# Altium schematic sheet ESP32.SchDoc
size A4; SheetNumber: 2; SheetTotal: 5
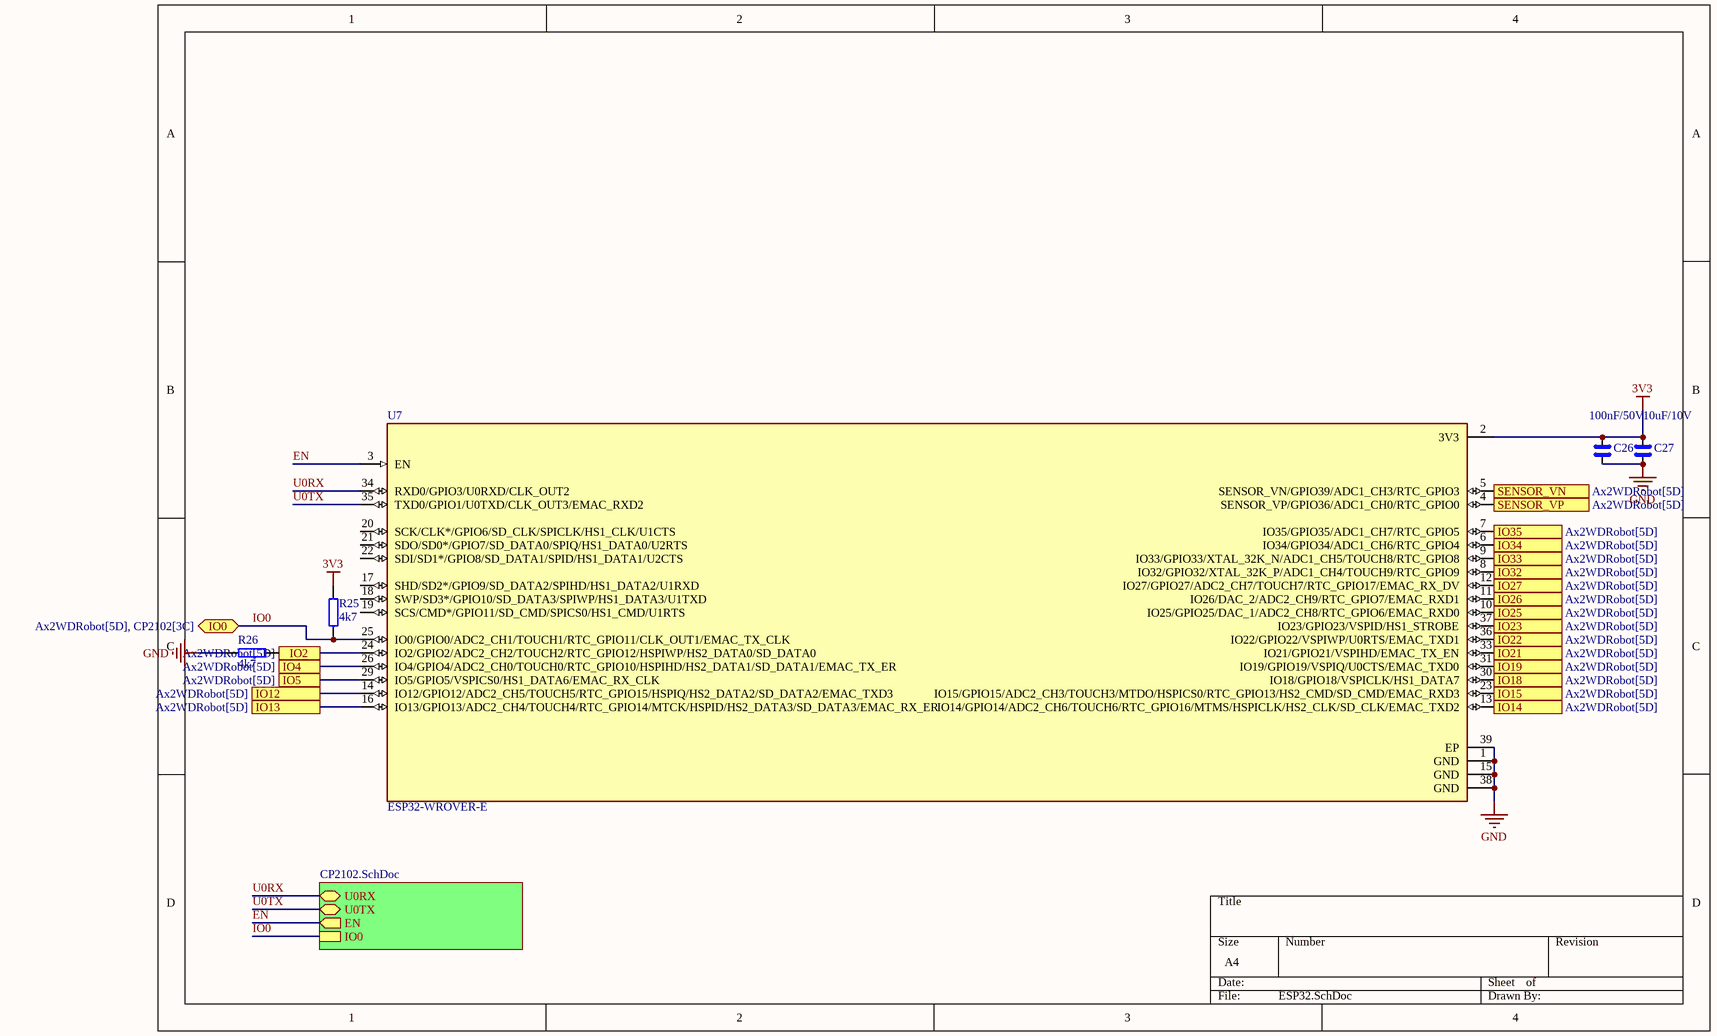
[diagram p0: ESP32.SchDoc]

## Parts
C26  100nF/50V  [1608[0603]]
C27  10uF/10V  [1608[0603]]
R25  4k7  [1608[0603]]
R26  4k7  [1608[0603]]
U7  ESP32-WROVER-E  [XCVR_ESP32-WROVER]

## Sub-sheets
? = CP2102.SchDoc: U0RX (bidir), U0TX (bidir), EN (out), IO0

## Ports
IO0 (bidir, see Ax2WDRobot[5D], CP2102[3C]), IO2 (see Ax2WDRobot[5D]), IO4 (see Ax2WDRobot[5D]), IO5 (see Ax2WDRobot[5D]), IO12 (see Ax2WDRobot[5D]), IO13 (see Ax2WDRobot[5D]), IO14 (see Ax2WDRobot[5D]), IO15 (see Ax2WDRobot[5D]), IO18 (see Ax2WDRobot[5D]), IO19 (see Ax2WDRobot[5D]), IO21 (see Ax2WDRobot[5D]), IO22 (see Ax2WDRobot[5D]), IO23 (see Ax2WDRobot[5D]), IO25 (see Ax2WDRobot[5D]), IO26 (see Ax2WDRobot[5D]), IO27 (see Ax2WDRobot[5D]), IO32 (see Ax2WDRobot[5D]), IO33 (see Ax2WDRobot[5D]), IO34 (see Ax2WDRobot[5D]), IO35 (see Ax2WDRobot[5D]), SENSOR_VN (see Ax2WDRobot[5D]), SENSOR_VP (see Ax2WDRobot[5D])

## Nets
3V3: C26.1 C27.1 R25.2 U7.2(3V3)
GND: C26.2 C27.2 R26.1 U7.1(GND) U7.15(GND) U7.38(GND) U7.39(EP)
EN: U7.3(EN) ; sheet /EN
IO0: R25.1 U7.25(IO0/GPIO0/ADC2_CH1/TOUCH1/RTC_GPIO11/CLK_OUT1/EMAC_TX_CLK) ; port IO0, sheet /IO0
IO2: R26.2 U7.24(IO2/GPIO2/ADC2_CH2/TOUCH2/RTC_GPIO12/HSPIWP/HS2_DATA0/SD_DATA0) ; port IO2
IO4: U7.26(IO4/GPIO4/ADC2_CH0/TOUCH0/RTC_GPIO10/HSPIHD/HS2_DATA1/SD_DATA1/EMAC_TX_ER) ; port IO4
IO5: U7.29(IO5/GPIO5/VSPICS0/HS1_DATA6/EMAC_RX_CLK) ; port IO5
IO12: U7.14(IO12/GPIO12/ADC2_CH5/TOUCH5/RTC_GPIO15/HSPIQ/HS2_DATA2/SD_DATA2/EMAC_TXD3) ; port IO12
IO13: U7.16(IO13/GPIO13/ADC2_CH4/TOUCH4/RTC_GPIO14/MTCK/HSPID/HS2_DATA3/SD_DATA3/EMAC_RX_ER) ; port IO13
IO14: U7.13(IO14/GPIO14/ADC2_CH6/TOUCH6/RTC_GPIO16/MTMS/HSPICLK/HS2_CLK/SD_CLK/EMAC_TXD2) ; port IO14
IO15: U7.23(IO15/GPIO15/ADC2_CH3/TOUCH3/MTDO/HSPICS0/RTC_GPIO13/HS2_CMD/SD_CMD/EMAC_RXD3) ; port IO15
IO18: U7.30(IO18/GPIO18/VSPICLK/HS1_DATA7) ; port IO18
IO19: U7.31(IO19/GPIO19/VSPIQ/U0CTS/EMAC_TXD0) ; port IO19
IO21: U7.33(IO21/GPIO21/VSPIHD/EMAC_TX_EN) ; port IO21
IO22: U7.36(IO22/GPIO22/VSPIWP/U0RTS/EMAC_TXD1) ; port IO22
IO23: U7.37(IO23/GPIO23/VSPID/HS1_STROBE) ; port IO23
IO25: U7.10(IO25/GPIO25/DAC_1/ADC2_CH8/RTC_GPIO6/EMAC_RXD0) ; port IO25
IO26: U7.11(IO26/DAC_2/ADC2_CH9/RTC_GPIO7/EMAC_RXD1) ; port IO26
IO27: U7.12(IO27/GPIO27/ADC2_CH7/TOUCH7/RTC_GPIO17/EMAC_RX_DV) ; port IO27
IO32: U7.8(IO32/GPIO32/XTAL_32K_P/ADC1_CH4/TOUCH9/RTC_GPIO9) ; port IO32
IO33: U7.9(IO33/GPIO33/XTAL_32K_N/ADC1_CH5/TOUCH8/RTC_GPIO8) ; port IO33
IO34: U7.6(IO34/GPIO34/ADC1_CH6/RTC_GPIO4) ; port IO34
IO35: U7.7(IO35/GPIO35/ADC1_CH7/RTC_GPIO5) ; port IO35
SENSOR_VN: U7.5(SENSOR_VN/GPIO39/ADC1_CH3/RTC_GPIO3) ; port SENSOR_VN
SENSOR_VP: U7.4(SENSOR_VP/GPIO36/ADC1_CH0/RTC_GPIO0) ; port SENSOR_VP
U0RX: U7.34(RXD0/GPIO3/U0RXD/CLK_OUT2) ; sheet /U0RX
U0TX: U7.35(TXD0/GPIO1/U0TXD/CLK_OUT3/EMAC_RXD2) ; sheet /U0TX

Not connected (* = marked no-connect by the designer): U7 17(SHD/SD2*/GPIO9/SD_DATA2/SPIHD/HS1_DATA2/U1RXD) 18(SWP/SD3*/GPIO10/SD_DATA3/SPIWP/HS1_DATA3/U1TXD) 19(SCS/CMD*/GPIO11/SD_CMD/SPICS0/HS1_CMD/U1RTS) 20(SCK/CLK*/GPIO6/SD_CLK/SPICLK/HS1_CLK/U1CTS) 21(SDO/SD0*/GPIO7/SD_DATA0/SPIQ/HS1_DATA0/U2RTS) 22(SDI/SD1*/GPIO8/SD_DATA1/SPID/HS1_DATA1/U2CTS)

## Library data of the parts
C26 = C: Cap Ceramic 0.1uF 50V X7R 20% SMD 0603 125C Paper T/R; Supplier 1: Digi-Key; Supplier Part Number 1: 1276-1941-1-ND; Case/Package: 0603; LCSCPartNo: C14663
C27 = C: Capacitor; Supplier 1: Digi-Key; Supplier Part Number 1: 1276-1096-1-ND; Case/Package: 0603; LCSCPartNo: C19702
R25 R26 = R: RES SMD 4.7K OHM 1% 1/10W 0603; Supplier 1: Digi-Key; Supplier Part Number 1: 311-4.70KHRCT-ND; Case/Package: 0603; LCSCPartNo: C23162
U7 = ESP32-WROVER: Bluetooth, WiFi 802.11b/g/n, Bluetooth v4.2 + EDR, Class 1, 2 and 3 Transceiver Module 2.4GHz ~ 2.5GHz PCB Trace Surface Mount; LCSCPartNo: C2973667